# Altium schematic sheet Ethernet.SchDoc
size A4; SheetNumber: 3; SheetTotal: 5
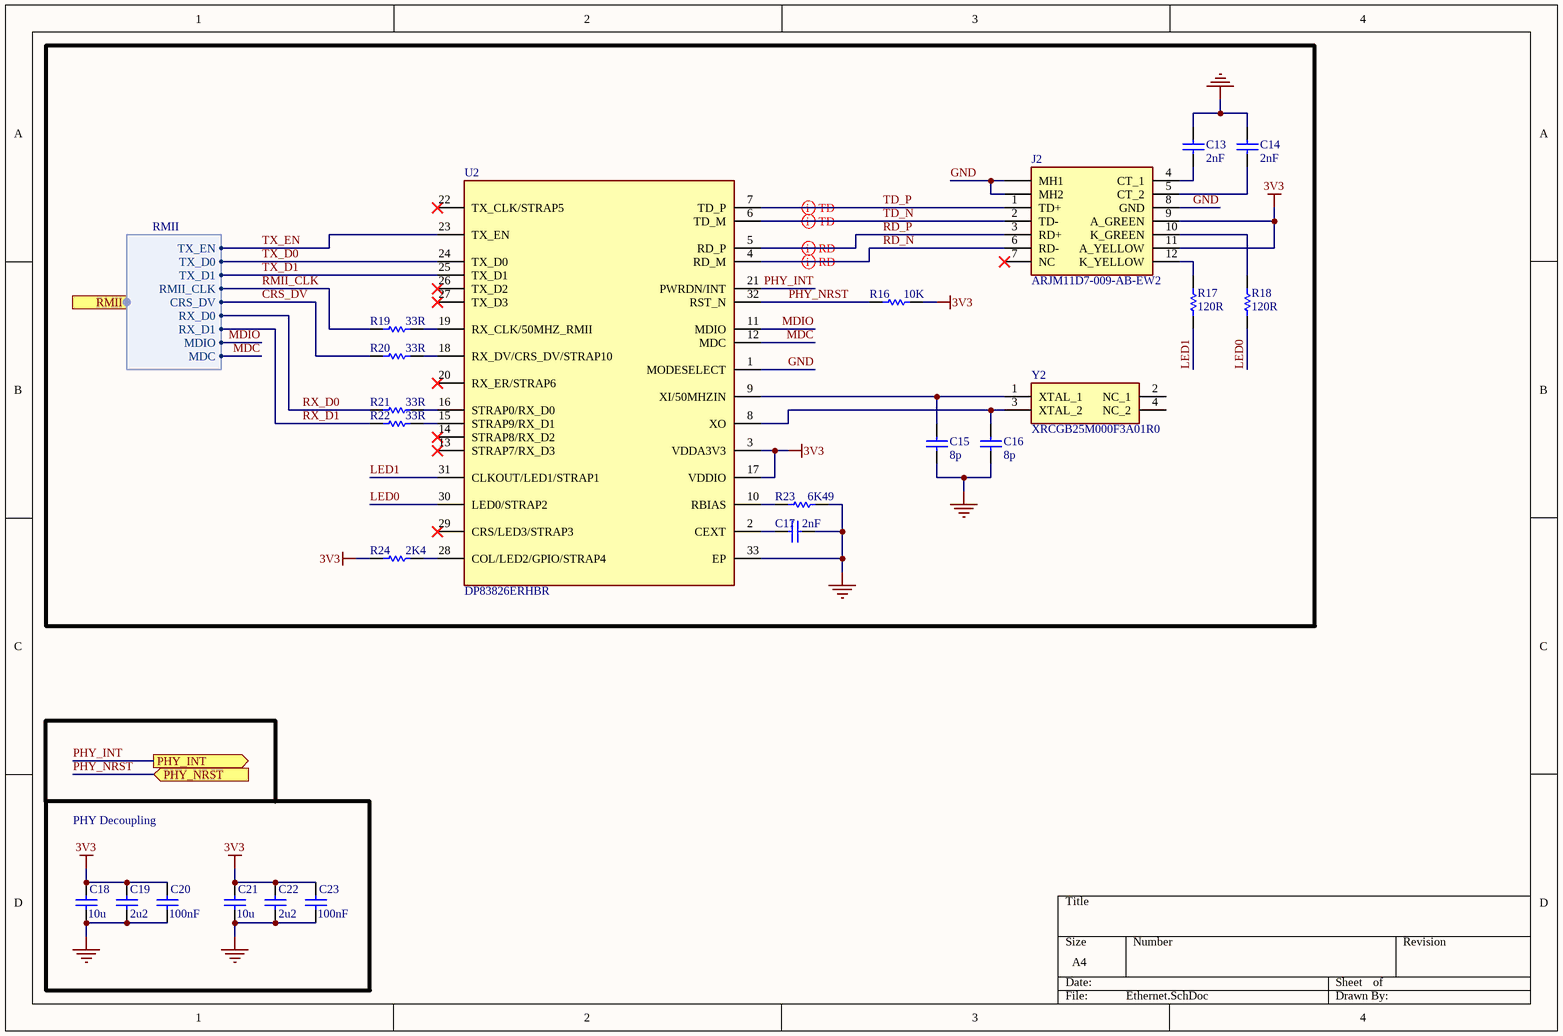
[diagram p0: Ethernet.SchDoc]

## Parts
C13  2nF  [0603]
C14  2nF  [0603]
C15  8p  [0603]
C16  8p  [0603]
C17  2nF  [0603]
C18  10u  [1206]
C19  2u2  [1206]
C20  100nF  [0603]
C21  10u  [1206]
C22  2u2  [1206]
C23  100nF  [0603]
J2  ARJM11D7-009-AB-EW2  [ARJM11D7009ABEW2]
R16  10K  [0603]
R17  120R  [0603]
R18  120R  [0603]
R19  33R  [0603]
R20  33R  [0603]
R21  33R  [0603]
R22  33R  [0603]
R23  6K49  [0603]
R24  2K4  [0603]
U2  DP83826ERHBR  [QFN50P500X500X100-33N-D]
Y2  XRCGB25M000F3A01R0  [XRCGB]

## Blocks framed on the sheet
PHY Decoupling: C18-C23

## Ports
PHY_INT (out, see Main[1A], Controller[1D]), PHY_NRST (in, see Main[1B], Controller[1D]), RMII (harness RMII, see Main[1A], Controller[3D])

## Harnesses
RMII: TX_EN, TX_D0, TX_D1, RMII_CLK, CRS_DV, RX_D0, RX_D1, MDIO, MDC

## Nets
3V3: C18.2 C19.2 C20.2 C21.2 C22.2 C23.2 J2.9(A_GREEN) J2.11(A_YELLOW) R16.2 R24.1 U2.3(VDDA3V3) U2.17(VDDIO)
GND: C13.2 C14.2 C15.1 C16.1 C17.2 C18.1 C19.1 C20.1 C21.1 C22.1 C23.1 J2.8(GND) J2.MH1 J2.MH2 R23.2 U2.1(MODESELECT) U2.33(EP)
CRS_DV: R20.1 ; port RMII.CRS_DV
LED0: R18.1 U2.30(LED0/STRAP2)
LED1: R17.1 U2.31(CLKOUT/LED1/STRAP1)
MDC: U2.12(MDC) ; port RMII.MDC
MDIO: U2.11(MDIO) ; port RMII.MDIO
PHY_INT: U2.21(PWRDN/INT) ; port PHY_INT
PHY_NRST: R16.1 U2.32(RST_N) ; port PHY_NRST
RD_N: J2.6(RD-) U2.4(RD_M)
RD_P: J2.3(RD+) U2.5(RD_P)
RMII_CLK: R19.1 ; port RMII.RMII_CLK
RX_D0: R21.1 ; port RMII.RX_D0
RX_D1: R22.1 ; port RMII.RX_D1
TD_N: J2.2(TD-) U2.6(TD_M)
TD_P: J2.1(TD+) U2.7(TD_P)
TX_D0: U2.24(TX_D0) ; port RMII.TX_D0
TX_D1: U2.25(TX_D1) ; port RMII.TX_D1
TX_EN: U2.23(TX_EN) ; port RMII.TX_EN
NetC13_1: C13.1 J2.4(CT_1)
NetC14_1: C14.1 J2.5(CT_2)
NetC15_2: C15.2 U2.9(XI/50MHZIN) Y2.1(XTAL_1)
NetC16_2: C16.2 U2.8(XO) Y2.3(XTAL_2)
NetC17_1: C17.1 U2.2(CEXT)
NetJ2_10: J2.10(K_GREEN) R18.2
NetJ2_12: J2.12(K_YELLOW) R17.2
NetR19_2: R19.2 U2.19(RX_CLK/50MHZ_RMII)
NetR20_2: R20.2 U2.18(RX_DV/CRS_DV/STRAP10)
NetR21_2: R21.2 U2.16(STRAP0/RX_D0)
NetR22_2: R22.2 U2.15(STRAP9/RX_D1)
NetR23_1: R23.1 U2.10(RBIAS)
NetR24_2: R24.2 U2.28(COL/LED2/GPIO/STRAP4)

Not connected (* = marked no-connect by the designer): J2 7(NC)*; U2 13(STRAP7/RX_D3)* 14(STRAP8/RX_D2)* 20(RX_ER/STRAP6)* 22(TX_CLK/STRAP5)* 26(TX_D2)* 27(TX_D3)* 29(CRS/LED3/STRAP3)*; Y2 2(NC_1) 4(NC_2)

## Layout directives
differential pair: RD_N, RD_P, TD_N, TD_P

## Library data of the parts
C13 C14 C17 = C0603C202J5GACTU: Capacitor 50V / 0603; Value: 2nF
C15 C16 = 06033A8R0DAT2A: Capacitor 25V / 0603; Value: 8p
C18 C21 = C1206C106K3PACTU: Capacitor 50V / 1206; Value: 10u
C19 C22 = C1206C225K5RACAUTO7210: Capacitor 50V / 1206; Value: 2.2u
C20 C23 = C0603C104K1RACAUTO: Capacitor 100V / 0603; Value: 100n
J2 = ARJM11D7-009-AB-EW2: Connector; Manufacturer_Name: ABRACON; Datasheet Link: https://abracon.com/Magnetics/ARJM11.pdf; Height: 14.05mm; Manufacturer_Part_Number: ARJM11D7-009-AB-EW2; Mouser Part Number: 815-RJM11D7009ABEW2; Mouser Price/Stock: https://www.mouser.co.uk/ProductDetail/ABRACON/ARJM11D7-009-AB-EW2?qs=YCa%2FAAYMW01wgGAVSiGYdQ%3D%3D; Arrow Part Number: ARJM11D7-009-AB-EW2; Arrow Price/Stock: https://www.arrow.com/en/products/arjm11d7-009-ab-ew2/abracon?utm_currency=USD&region=europe
R16 = CRCW060310K0FKEA: Resistor 0.1W; Value: 10K
R17 R18 = CRCW0603120RFKEA: Resistor 0.1W; Value: 120R
R19-R22 = CRCW060333R0FKEA: Resistor 0.1W; Value: 33R
R23 = CRCW06036K49FKEA: Resistor 0.1W; Value: 6K49
R24 = CRCW06032K40FKEA: Resistor 0.1W; Value: 2K4
U2 = DP83826ERHBR: Integrated Circuit; Manufacturer_Name: Texas Instruments; Datasheet Link: https://www.ti.com/lit/ds/symlink/dp83826i.pdf?ts=1636699378977&ref_url=https%253A%252F%252Fwww.ti.com%252Fproduct%252FDP83826I; Height: 1mm; Manufacturer_Part_Number: DP83826ERHBR; Mouser Part Number: 595-DP83826ERHBR; Mouser Price/Stock: https://www.mouser.co.uk/ProductDetail/Texas-Instruments/DP83826ERHBR?qs=xZ%2FP%252Ba9zWqY4e7L7xapfgA%3D%3D; Arrow Part Number: DP83826ERHBR; Arrow Price/Stock: https://www.arrow.com/en/products/dp83826erhbr/texas-instruments?region=nac
Y2 = XRCGB25M000F3A01R0: Crystal or Oscillator; Manufacturer_Name: Murata Electronics; Datasheet Link: https://www.murata.com/products/productdata/8803384393758/SPEC-XRCGB25M000F3A01R0.pdf; Height: 0.7mm; Manufacturer_Part_Number: XRCGB25M000F3A01R0; Mouser Part Number: 81-XRCGB25M000F3A01R; Mouser Price/Stock: https://www.mouser.co.uk/ProductDetail/Murata-Electronics/XRCGB25M000F3A01R0?qs=xZ%2FP%252Ba9zWqYh5DvumW%252BlTA%3D%3D; Arrow Part Number: XRCGB25M000F3A01R0; Arrow Price/Stock: https://www.arrow.com/en/products/xrcgb25m000f3a01r0/murata-manufacturing?region=nac